# Altium schematic sheet BeagleBone_RF_Cape_Rev A2_Cover_Page .SchDoc: RF Adaptor Cape
size A4; Date: Not shown in title block; ApprovedBy: Not shown in title block; CheckedBy: Not shown in title block; Author: Not shown in title block; CompanyName: Not shown in title block; DrawnBy: Grant Smith; Engineer: Grant Smith; Organization: Texas Instruments; Address1: Not shown in title block; Address2: Not shown in title block; Address3: Not shown in title block; Address4: Not shown in title block; DocumentNumber: 1; Revision: 0.1; SheetNumber: 1; SheetTotal: 2; PageSetup: Record=PageOptions|CenterHorizontal=True|CenterVertical=True|PrintScale=0.93|XCorrection=1.00|YCorrection=1.00|PrintKind=0|BorderSize=5000000|LeftOffset=0|BottomOffset=0|Orientation=2|PaperLength=1000|PaperWidth=1000|Scale=100|PaperSource=15|PrintQuality=600|MediaType=1|DitherType=10|PaperKind=Letter|PrintScaleMode=1; PRJ Title: RF Cape; CurrentTime: Not shown in title block; CurrentDate: Not shown in title block; Time: Not shown in title block; DocumentFullPathAndName: Not shown in title block; DocumentName: Not shown in title block; ModifiedDate: Not shown in title block; ImagePath: Not shown in title block; ProjectName: RF Cape for Beaglebone
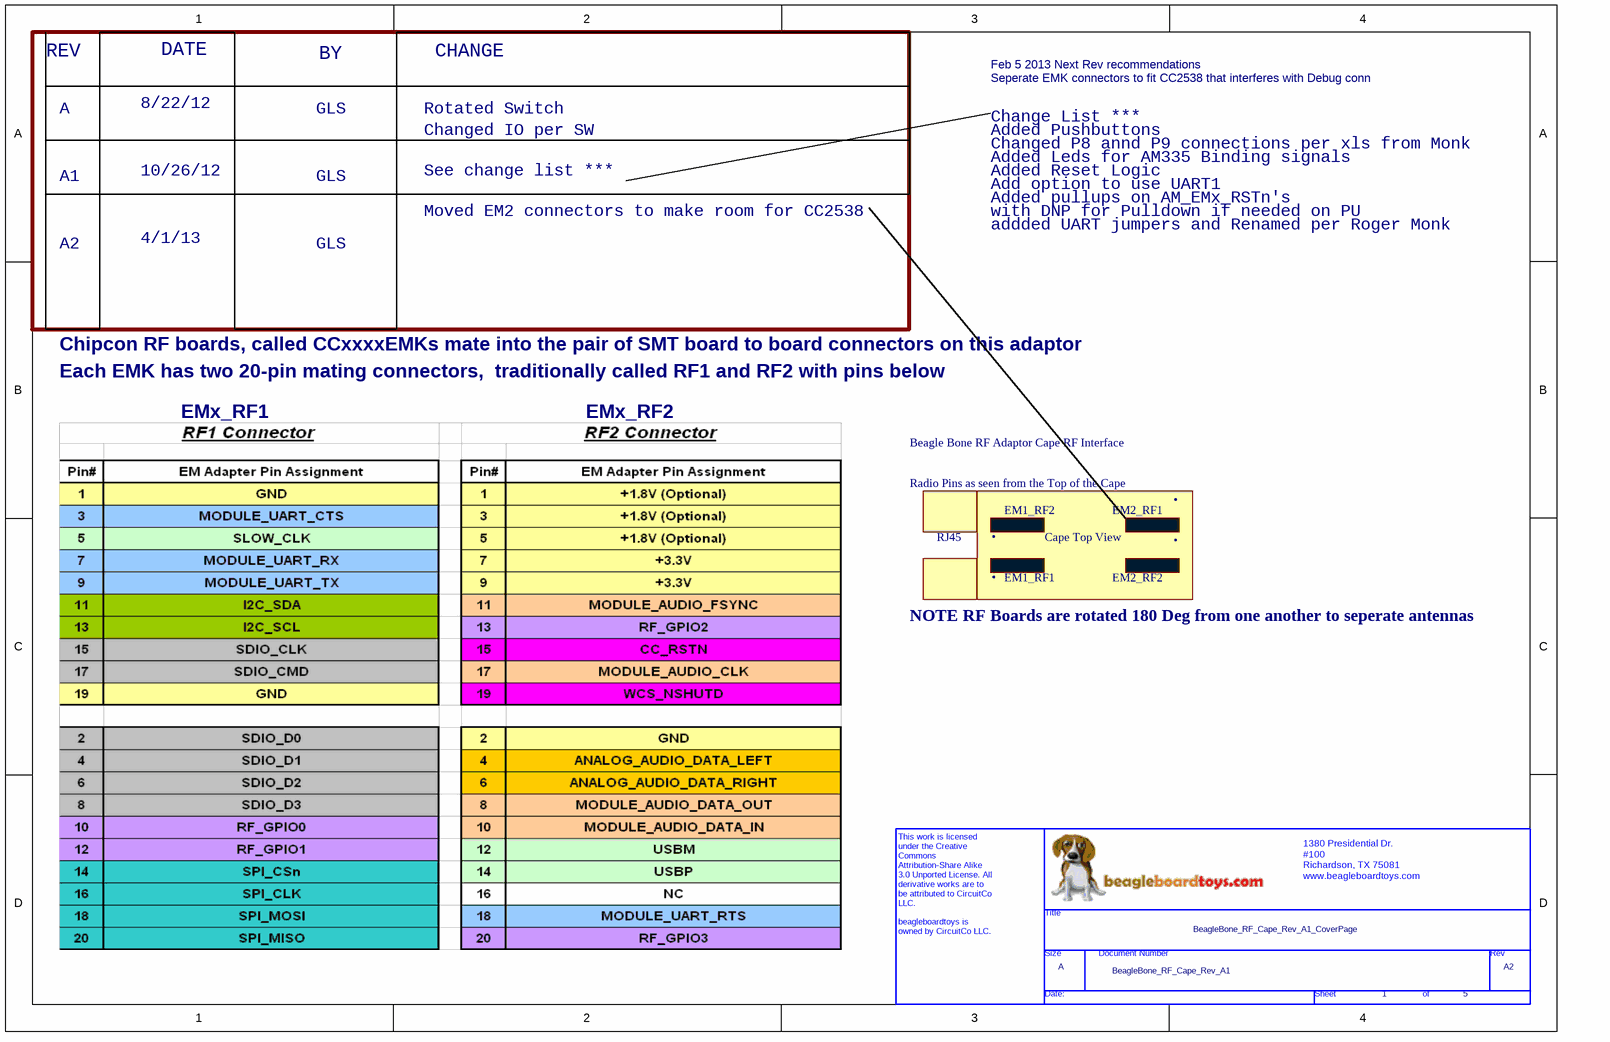
[diagram p0: BeagleBone_RF_Cape_Rev A2_Cover_Page .SchDoc]

## Parts
*?  Page Count: 5  Page Number: 1  Page Size: A  Title: BeagleBone_RF_Cape_Rev_A1_CoverPage  RevCode: A2  Doc: BeagleBone_RF_Cape_Rev_A1  (hidden comment: BBT_OPENSOURCE)  (graphical)

## Notes on the sheet
- REV
- A
- 8/22/12
- DATE
- GLS
- BY
- Rotated Switch
- CHANGE
- Feb 5 2013 Next Rev recommendations
- Seperate EMK connectors to fit CC2538 that interferes with Debug conn
- A1
- 10/26/12
- Changed IO per SW
- See change list ***
- Added Pushbuttons
- Changed P8 annd P9 connections per xls from Monk
- Added Leds for AM335 Binding signals
- Added Reset Logic
- Change List ***
- A2
- 4/1/13
- Moved EM2 connectors to make room for CC2538
- Add option to use UART1
- addded UART jumpers and Renamed per Roger Monk
- Added pullups on AM_EMx_RSTn's
- with DNP for Pulldown if needed on PU
- Chipcon RF boards, called CCxxxxEMKs mate into the pair of SMT board to board connectors on this adaptor
- Each EMK has two 20-pin mating connectors,  traditionally called RF1 and RF2 with pins below
- EMx_RF1
- EMx_RF2
- Beagle Bone RF Adaptor Cape RF Interface
- Radio Pins as seen from the Top of the Cape
- EM1_RF2
- EM2_RF1
- .
- RJ45
- EM1_RF1
- Cape Top View
- EM2_RF2
- NOTE RF Boards are rotated 180 Deg from one another to seperate antennas
- (in symbol BBT_OPENSOURCE) 1380 Presidential Dr. / #100 / Richardson, TX 75081 / www.beagleboardtoys.com /; Title; Size; Document Number; Rev; Date:; Sheet; of; This work is licensed / under the Creative / Commons / Attribution-Share Alike / 3.0 Unported License. All / derivative works are to / be attributed to CircuitCo / LLC. / beagleboardtoys is / owned by CircuitCo LLC. /

## Library data of the parts
*? = BBT_OPENSOURCE: OrgName: BBT; Page Create Date: July 16 2012